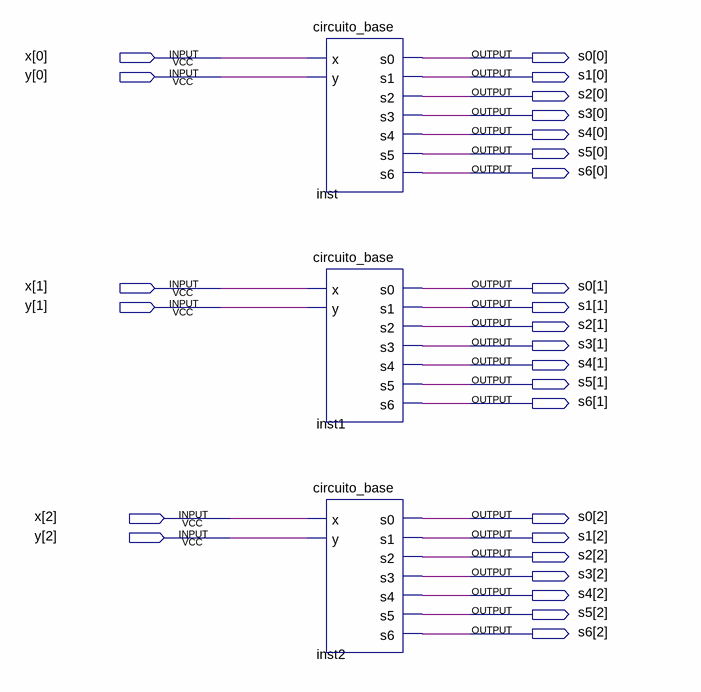
[diagram p0: schematic sheet]
// Quartus schematic seven_segment_display.bdf as structural Verilog: 3 symbols, 27 pins
module seven_segment_display (
  input  [2:0] x,
  input  [2:0] y,
  output [2:0] s0,
  output [2:0] s1,
  output [2:0] s2,
  output [2:0] s3,
  output [2:0] s4,
  output [2:0] s5,
  output [2:0] s6
);

  circuito_base inst (
    .x(x[0]), .y(y[0]), .s0(s0[0]), .s1(s1[0]), .s2(s2[0]), .s3(s3[0]), .s4(s4[0]), .s5(s5[0]), .s6(s6[0]));
  circuito_base inst1 (
    .x(x[1]), .y(y[1]), .s0(s0[1]), .s1(s1[1]), .s2(s2[1]), .s3(s3[1]), .s4(s4[1]), .s5(s5[1]), .s6(s6[1]));
  circuito_base inst2 (
    .x(x[2]), .y(y[2]), .s0(s0[2]), .s1(s1[2]), .s2(s2[2]), .s3(s3[2]), .s4(s4[2]), .s5(s5[2]), .s6(s6[2]));
endmodule
